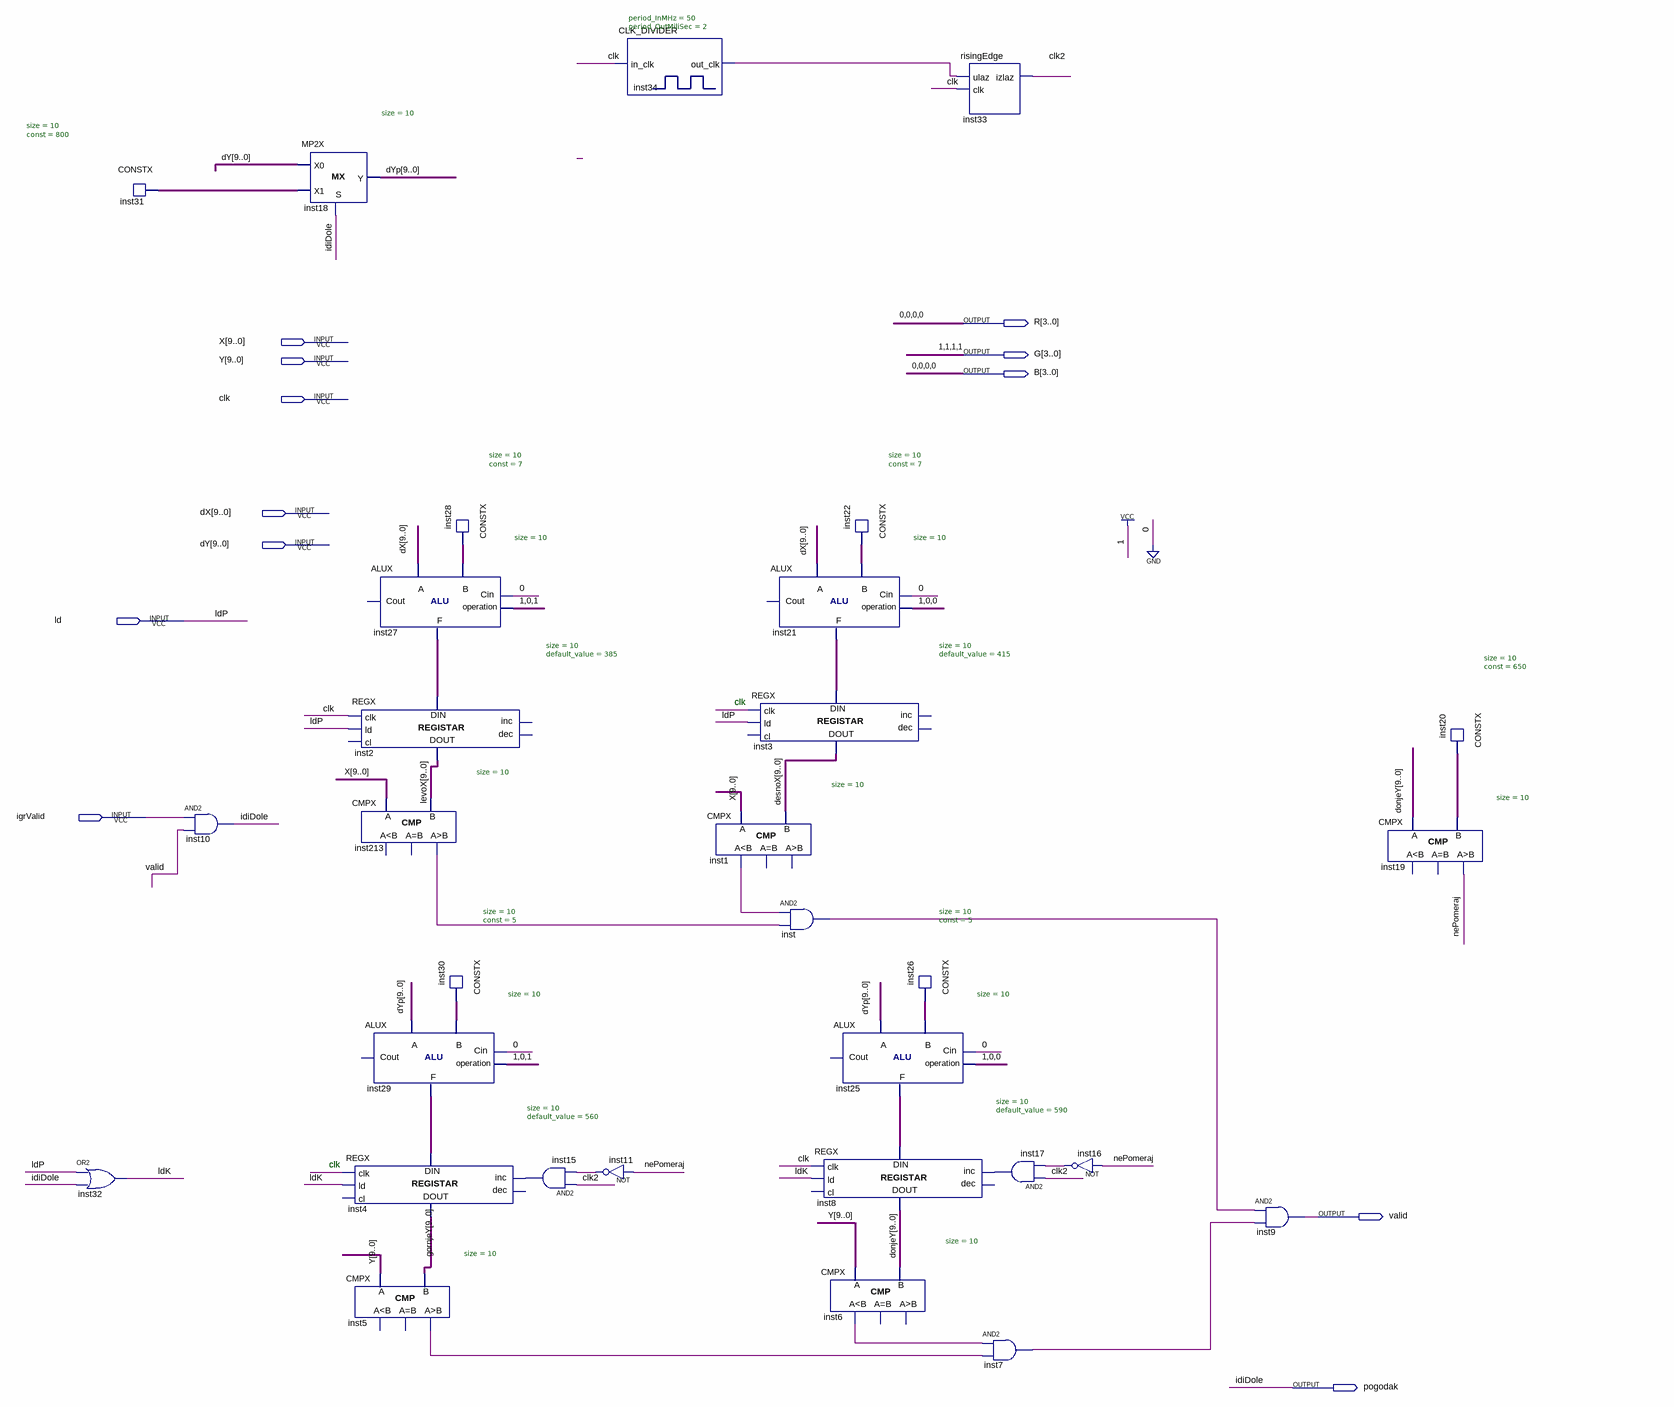
[diagram p0: schematic sheet]
// Quartus schematic nepProjektil.bdf as structural Verilog: 31 symbols, 12 pins
module nepProjektil (
  input  [9:0] X,
  input  [9:0] Y,
  input  clk,
  input  [9:0] dX,
  input  [9:0] dY,
  input  ld,
  input  igrValid,
  output [3:0] R,
  output [3:0] G,
  output [3:0] B,
  output valid,
  output pogodak
);

  wire clk2, inst1_ls, inst5_gr, inst6_ls, inst7_out, inst11_out, inst15_out, inst16_out, inst17_out,
       inst34_out_clk, inst213_gr, inst_out, ldK, nePomeraj;
  wire [9:0] desnoX, donjeY, dYp, gornjeY, inst20_data, inst21_f, inst22_data, inst25_f, inst26_data,
       inst27_f, inst28_data, inst29_f, inst30_data, inst31_data, levoX;

  CONSTX #(.size(10), .\const (800)) inst31 (.data(inst31_data));
  or inst32 (ldK, ld, pogodak);
  and inst10 (pogodak, igrValid, valid);
  MP2X #(.size(10)) inst18 (.S(pogodak), .X0(dY), .X1(inst31_data), .Y(dYp));
  ALUX #(.size(10)) inst27 (.Cin(1'b0), .B(inst28_data), .A(dX), .op(3'b101), .F(inst27_f));  // open: Cout
  REGX #(.size(10), .default_value(385)) inst2 (
    .clk(clk), .ld(ld), .data_in(inst27_f), .data_out(levoX));  // open: cl, inc, dec
  CMPX #(.size(10)) inst213 (.A(X), .B(levoX), .gr(inst213_gr));  // open: ls, eq
  ALUX #(.size(10)) inst29 (.Cin(1'b0), .B(inst30_data), .A(dYp), .op(3'b101), .F(inst29_f));  // open: Cout
  REGX #(.size(10), .default_value(560)) inst4 (
    .clk(clk), .ld(ldK), .inc(inst15_out), .data_in(inst29_f), .data_out(gornjeY));  // open: cl, dec
  CMPX #(.size(10)) inst5 (.A(Y), .B(gornjeY), .gr(inst5_gr));  // open: ls, eq
  CONSTX #(.size(10), .\const (7)) inst28 (.data(inst28_data));
  CONSTX #(.size(10), .\const (5)) inst30 (.data(inst30_data));
  and inst15 (inst15_out, clk2, inst11_out);
  CLK_DIVIDER #(.period_InMHz(50), .period_OutMiliSec(2)) inst34 (.in_clk(clk), .out_clk(inst34_out_clk));
  not inst11 (inst11_out, nePomeraj);
  CMPX #(.size(10)) inst1 (.A(X), .B(desnoX), .ls(inst1_ls));  // open: eq, gr
  ALUX #(.size(10)) inst21 (.Cin(1'b0), .B(inst22_data), .A(dX), .op(3'b100), .F(inst21_f));  // open: Cout
  REGX #(.size(10), .default_value(415)) inst3 (
    .clk(clk), .ld(ld), .data_in(inst21_f), .data_out(desnoX));  // open: cl, inc, dec
  and inst (inst_out, inst1_ls, inst213_gr);
  REGX #(.size(10), .default_value(590)) inst8 (
    .clk(clk), .ld(ldK), .inc(inst17_out), .data_in(inst25_f), .data_out(donjeY));  // open: cl, dec
  CMPX #(.size(10)) inst6 (.A(Y), .B(donjeY), .ls(inst6_ls));  // open: eq, gr
  CONSTX #(.size(10), .\const (7)) inst22 (.data(inst22_data));
  ALUX #(.size(10)) inst25 (.Cin(1'b0), .B(inst26_data), .A(dYp), .op(3'b100), .F(inst25_f));  // open: Cout
  CONSTX #(.size(10), .\const (5)) inst26 (.data(inst26_data));
  risingEdge inst33 (.ulaz(inst34_out_clk), .clk(clk), .izlaz(clk2));
  and inst17 (inst17_out, clk2, inst16_out);
  and inst7 (inst7_out, inst6_ls, inst5_gr);
  not inst16 (inst16_out, nePomeraj);
  and inst9 (valid, inst_out, inst7_out);
  CMPX #(.size(10)) inst19 (.A(donjeY), .B(inst20_data), .gr(nePomeraj));  // open: ls, eq
  CONSTX #(.size(10), .\const (650)) inst20 (.data(inst20_data));

  assign B = 4'b0000;
  assign G = 4'b1111;
  assign R = 4'b0000;

  // Other names for the same wires on the sheet: idiDole = pogodak; ldP = ld

  // Notes on the sheet:
  //   clk
  //   clk
endmodule
